# Altium schematic sheet SD_Card.SchDoc
size A4; SheetNumber: 3; SheetTotal: 7
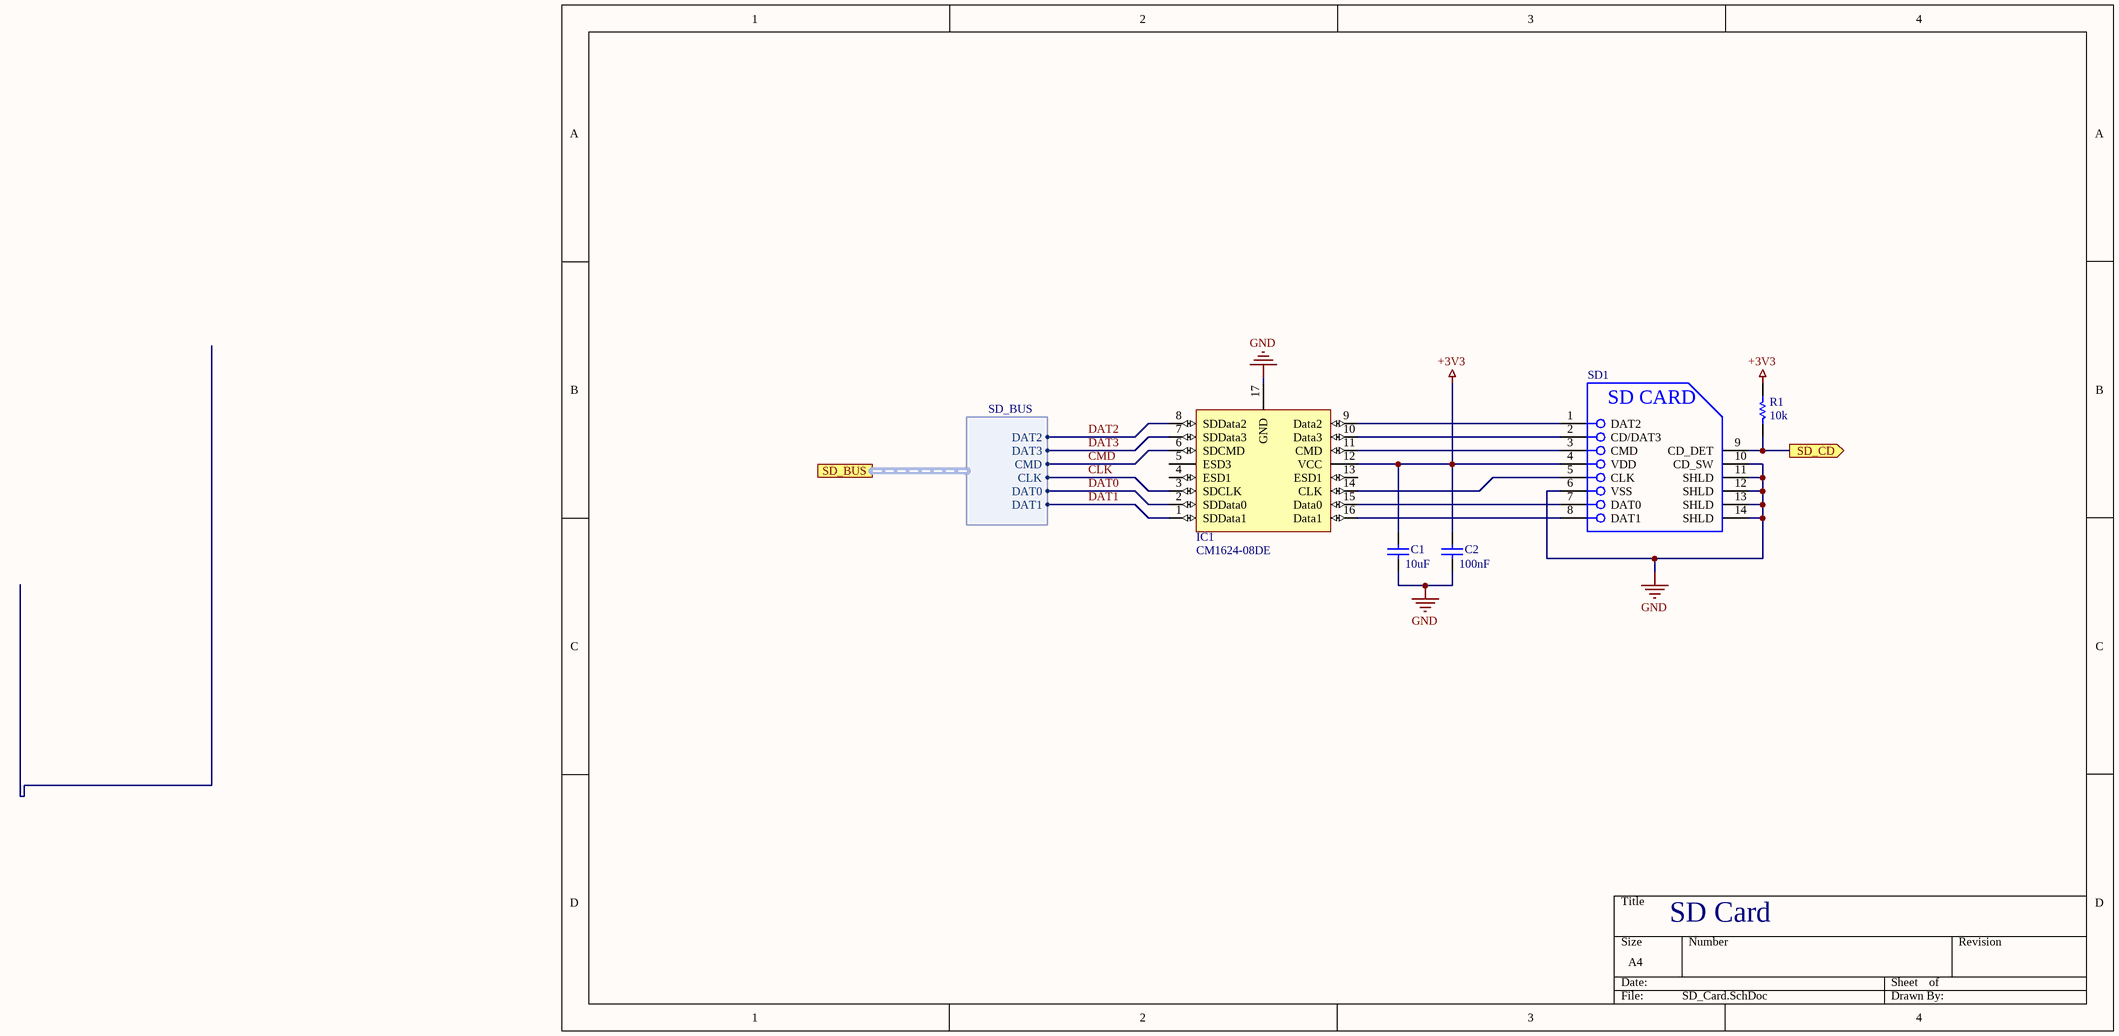
[diagram p0: SD_Card.SchDoc]

## Parts
C1  value 10uF  [CAPC2012X14N]  (hidden comment: C0805C106K8PACTU)
C2  value 100nF  [CAPC1608X10N]  (hidden comment: C0603C104M5RACTU)
IC1  CM1624-08DE  [SON40P140X55_HS-17N]
R1  value 10k  [RESC1608X06N]  (hidden comment: CRCW060310K0FKEA)
SD1  5027740891  [5027740891-Footprint-1]  (value not drawn)

## Ports
SD_BUS (harness SD_BUS, see Top Level[2C], Flight_Computer[4B]), SD_CD (out, see Top Level[2B], Flight_Computer[3C])

## Harnesses
SD_BUS: DAT1, DAT0, CLK, CMD, DAT3, DAT2

## Nets
+3V3: C1.2 C2.2 IC1.12(VCC) R1.2 SD1.4(VDD)
GND: C1.1 C2.1 IC1.17(GND) SD1.6(VSS) SD1.10(CD_SW) SD1.11(SHLD) SD1.12(SHLD) SD1.13(SHLD) SD1.14(SHLD)
CLK: IC1.3(SDCLK) ; port SD_BUS.CLK
CMD: IC1.6(SDCMD) ; port SD_BUS.CMD
DAT0: IC1.2(SDData0) ; port SD_BUS.DAT0
DAT1: IC1.1(SDData1) ; port SD_BUS.DAT1
DAT2: IC1.8(SDData2) ; port SD_BUS.DAT2
DAT3: IC1.7(SDData3) ; port SD_BUS.DAT3
SD_CD: R1.1 SD1.9(CD_DET) ; port SD_CD
NetIC1_9: IC1.9(Data2) SD1.1(DAT2)
NetIC1_10: IC1.10(Data3) SD1.2(CD/DAT3)
NetIC1_11: IC1.11(CMD) SD1.3(CMD)
NetIC1_14: IC1.14(CLK) SD1.5(CLK)
NetIC1_15: IC1.15(Data0) SD1.7(DAT0)
NetIC1_16: IC1.16(Data1) SD1.8(DAT1)

Not connected (* = marked no-connect by the designer): IC1 4(ESD1) 5(ESD3) 13(ESD1)

## Notes on the sheet
- SD Card
- (in symbol CMP-00007-2) SD CARD

## Library data of the parts
C1 = CMP-00046-3: CAP CER 10UF 10V X5R 0805; Dielectric Material: Ceramic; Dissipation Factor: 10%; Width: 1.2mm; Number of Pins: 2; Voltage: 10V; Packaging: Tape and Reel; Dielectric: X5R; Mount: Surface Mount; Case/Package: 0805; Thickness: 0.055inch; Package Quantity: 1; Voltage Rating (DC): 10V; Case Code (Imperial): 0805; Tolerance: 10%; Max Operating Temperature: 85°C; Radiation Hardening: No; Termination: SMD/SMT; Height: 1.25mm; Voltage Rating: 10V; Capacitance: 10uF; Length: 2mm; Min Operating Temperature: -55°C; Depth: 1.25mm; REACH SVHC: No SVHC; Case Code (Metric): 2012; Contact Plating: Tin,Matte; JLC_PN: C15850
C2 = CMP-00038-5: Cap Ceramic 0.1uF 50V X7R 20% SMD 0603 125C T/R; Dissipation Factor: 2.5%; Min Operating Temperature: -55°C; Contact Plating: Tin,Matte; Height: 0.8mm; Voltage Rating: 50V; REACH SVHC: No SVHC; Max Operating Temperature: 125°C; Termination: SMD/SMT; Package Quantity: 1; Capacitance: 100nF; Packaging: Tape and Reel; Width: 0.031inch; Depth: 0.8mm; Dielectric: X7R; Tolerance: 20%; Lead Pitch: 0.7mm; Thickness: 0.034inch; Length: 1.6mm; Dielectric Material: Ceramic; Radiation Hardening: No; Voltage Rating (DC): 50V; Case/Package: 0603; Case Code (Metric): 1608; Mount: Surface Mount,PCB; Case Code (Imperial): 0603; JLC_PN: C14663
IC1 = CMP-00015-3: EMI Filter Flat Style SMD T/R; Capacitance: 20pF; Operating Supply Voltage: 5V; ESD Protection: Yes; Clamping Voltage: 9V; DC Resistance (DCR): 40R; Number of Channels: 6; Number of Lines: 8; Direction: Bidirectional; Depth: 1.45mm; Length: 3.4mm; Height: 0.022inch; Halogen Free: Halogen Free; REACH SVHC: No SVHC; Contact Plating: Tin,Matte; Number of Pins: 16; Termination: Flat; Package Quantity: 1; Min Operating Temperature: -40°C; Lead Free: Lead Free; Packaging: Tape and Reel; Case/Package: DFN; Max Operating Temperature: 85°C; Width: 1.35mm
R1 = CMP-00042-5: VISHAY - CRCW060310K0FKEA - SMD Chip Resistor, 0603 [1608 Metric], 10 kohm, CRCW e3 Series, 75 V, Thick Film, 100 mW; Voltage Rating: 75V; Temperature Coefficient: 100ppm/°C; Resistance: 10kR; Power Rating: 100mW; Tolerance: 1%; Number of Terminations: 2; Termination: SMD/SMT; Weight: 7.1E-05oz; Contact Plating: Tin,Lead; Max Operating Temperature: 155°C; Voltage Rating (DC): 75V; Military Standard: Not; Min Operating Temperature: -55°C; Depth: 0.85mm; Lead Free: Lead Free; Width: 0.033inch; Max Power Dissipation: 100mW; Features: Automotive AEC-Q200; Number of Pins: 2; Package Quantity: 10; Case/Package: 0603; Height: 0.45mm; Radiation Hardening: No; REACH SVHC: Unknown; Packaging: Tape and Reel; Length: 1.55mm; Case Code (Metric): 1608; Case Code (Imperial): 0603; Composition: Thick Film; JLC_PN: C25804
SD1 = CMP-00007-2: MOLEX   502774-0891.   MEMORY CARD CONNECTOR, MICROSD, 8POS; Current Rating: 500mA; Number of Contacts: 8; Pitch: 1.1mm; Gender: Male; Max Voltage Rating (DC): 1.01kV; Voltage Rating (AC): 10V; Max Operating Temperature: 85°C; Radiation Hardening: No; Depth: 16mm; Number of Rows: 1; Mount: Surface Mount,Reverse; Height: 1.8mm; Min Operating Temperature: -25°C; Length: 14.6mm; Package Quantity: 1; Contact Material: Copper Alloy,Copper; Housing Material: Polymer; Width: 1.8mm; Contact Plating: Gold; Orientation: Right Angle; Number of Circuits: 8; REACH SVHC: Unknown; Packaging: Tape and Reel; Halogen Free: Low Halogen; Termination: Solder; Connector Type: Connector